# EAGLE design TIMER555 copy (EAGLE 9.6.2)
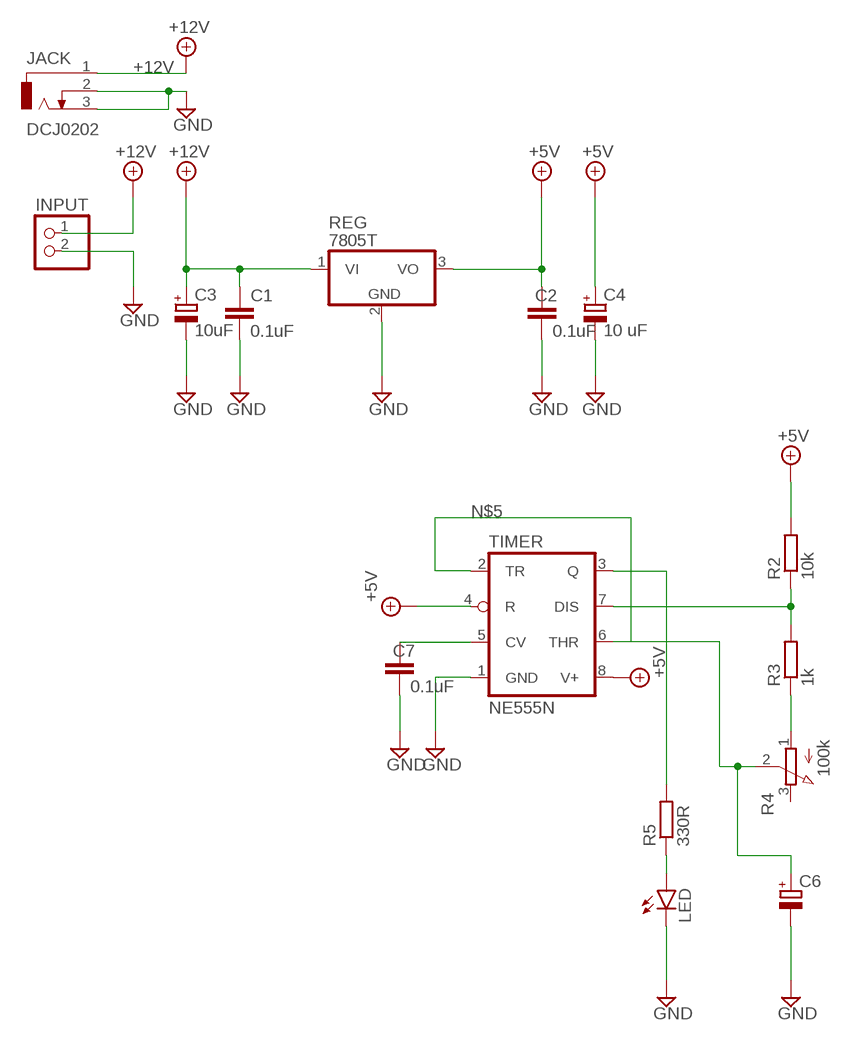
[diagram p0: schematic, sheet 1]

## Parts
C1  0.1uF  C-EU050-030X075  [C050-030X075]
C2  0.1uF  C-EU050-030X075  [C050-030X075]
C3  10uF  CPOL-EUE3.5-8  [E3,5-8]
C4  10 uF  CPOL-EUE3.5-8  [E3,5-8]
C6  CPOL-EUE3.5-8  [E3,5-8]
C7  0.1uF  C-EU050-030X075  [C050-030X075]
INPUT  PINHD-1X2  [1X02]
JACK  DCJ0202  [DCJ0202]
LED  LED5MM  [LED5MM]
R2  10k  R-EU_0207/10  [0207/10]
R3  1k  R-EU_0207/10  [0207/10]
R4  100k  3RP/1610N  [3RP/1610N]
R5  330R  R-EU_0207/10  [0207/10]
REG  7805T  [TO220H]
TIMER  NE555N  [DIL08]

## Nets
+5V [Power]: C2.1 C4.+ R2.2 REG.3(VO) TIMER.4(R) TIMER.8(V+)
+12V [Power]: C1.1 C3.+ INPUT.1 JACK.1 REG.1(VI)
GND [Power]: C1.2 C2.2 C3.- C4.- C6.- C7.2 INPUT.2 JACK.2 JACK.3 LED.K(C) REG.2(GND) TIMER.1(GND)
N$1: C7.1 TIMER.5(CV)
N$2: R2.1 R3.2 TIMER.7(DIS)
N$3: R3.1 R4.1(A)
N$5: C6.+ R4.2(S) TIMER.2(TR) TIMER.6(THR)
N$6: R5.2 TIMER.3(Q)
N$7: LED.A R5.1
Unconnected: R4.3(E)

## Library data of the parts
C1 C2 C7 = rcl:C-EU: CAPACITOR, European symbol; SPICEPREFIX: C
C3 C4 C6 = rcl:CPOL-EU: POLARIZED CAPACITOR, European symbol; SPICEPREFIX: C
INPUT = pinhead:PINHD-1X2: PIN HEADER
JACK = con-jack:DCJ0202: DC POWER JACK Source: DCJ0202.pdf; OC_FARNELL: unknown; OC_NEWARK: unknown
LED = led:LED: LED OSRAM: - CHIPLED LG R971, LG N971, LY N971, LG Q971, LY Q971, LO R971, LY R971 LH N974, LH R974 LS Q976, LO Q976, LY Q976 LO Q996 - Hyper CHIPLED LW Q18S LB Q993, LB Q99A, LB R99A - SideLED LS A670, LO A670, LY A670, LG A670, LP A670 LB A673, LV A673, LT A673, LW A673 LH A674 LY A675 LS A676, LA A676, LO A676, LY A676, LW A676 LS A679, LY A679, LG A679 - Hyper Micro SIDELED® LS Y876, LA Y876, LO Y876, LY Y876 LT Y87S - SmartLED LW L88C, LW L88S LB L89C, LB L89S, LG L890 LS L89K, LO L89K, LY L89K LS L896, LA L896, LO L896, LY L896 - TOPLED LS T670, LO T670, LY T670, LG T670, LP T670 LSG T670, LSP T670, LSY T670, LOP T670, LYG T670 LG T671, LOG T671, LSG T671 LB T673, LV T673, LT T673, LW T673 LH T674 LS T676, LA T676, LO T676, LY T676, LB T676, LH T676, LSB T676, LW T676 LB T67C, LV T67C, LT T67C, LS T67K, LO T67K, LY T67K, LW E67C LS E67B, LA E67B, LO E67B, LY E67B, LB E67C, LV E67C, LT E67C LW T67C LS T679, LY T679, LG T679 LS T770, LO T770, LY T770, LG T770, LP T770 LB T773, LV T773, LT T773, LW T773 LH T774 LS E675, LA E675, LY E675, LS T675 LS T776, LA T776, LO T776, LY T776, LB T776 LHGB T686 LT T68C, LB T68C - Hyper Mini TOPLED® LB M676 - Mini TOPLED Santana® LG M470 LS M47K, LO M47K, LY M47K Source: http://www.osram.convergy.de LUXEON: - LUMILED® LXK2-PW12-R00, LXK2-PW12-S00, LXK2-PW14-U00, LXK2-PW14-V00 LXK2-PM12-R00, LXK2-PM12-S00, LXK2-PM14-U00 LXK2-PE12-Q00, LXK2-PE12-R00, LXK2-PE12-S00, LXK2-PE14-T00, LXK2-PE14-U00 LXK2-PB12-K00, LXK2-PB12-L00, LXK2-PB12-M00, LXK2-PB14-N00, LXK2-PB14-P00, LXK2-PB14-Q00 LXK2-PR12-L00, LXK2-PR12-M00, LXK2-PR14-Q00, LXK2-PR14-R00 LXK2-PD12-Q00, LXK2-PD12-R00, LXK2-PD12-S00 LXK2-PH12-R00, LXK2-PH12-S00 LXK2-PL12-P00, LXK2-PL12-Q00, LXK2-PL12-R00 Source: www.luxeon.com KINGBRIGHT: KA-3528ASYC Source: www.kingbright.com
R2 R3 R5 = rcl:R-EU_: RESISTOR, European symbol; SPICEPREFIX: R
R4 = pot:3RP/1610N: 16mm Potentiometer one level Source: http://www.alphapotentiometers.net/html/16mm_pot_2.html
REG = linear:78*: Positive VOLTAGE REGULATOR Source: http://cache.national.com/ds/LM/LM78L05.pdf http://www.fairchildsemi.com/ds/LM/LM7805.pdf
TIMER = linear:*555: TIMER

## Net classes
0 default: width 0.305 mm, drill 0.305 mm, clearance 0.254 mm
1 Power: width 0.406 mm, drill 0.406 mm, clearance 0.305 mm

## Board
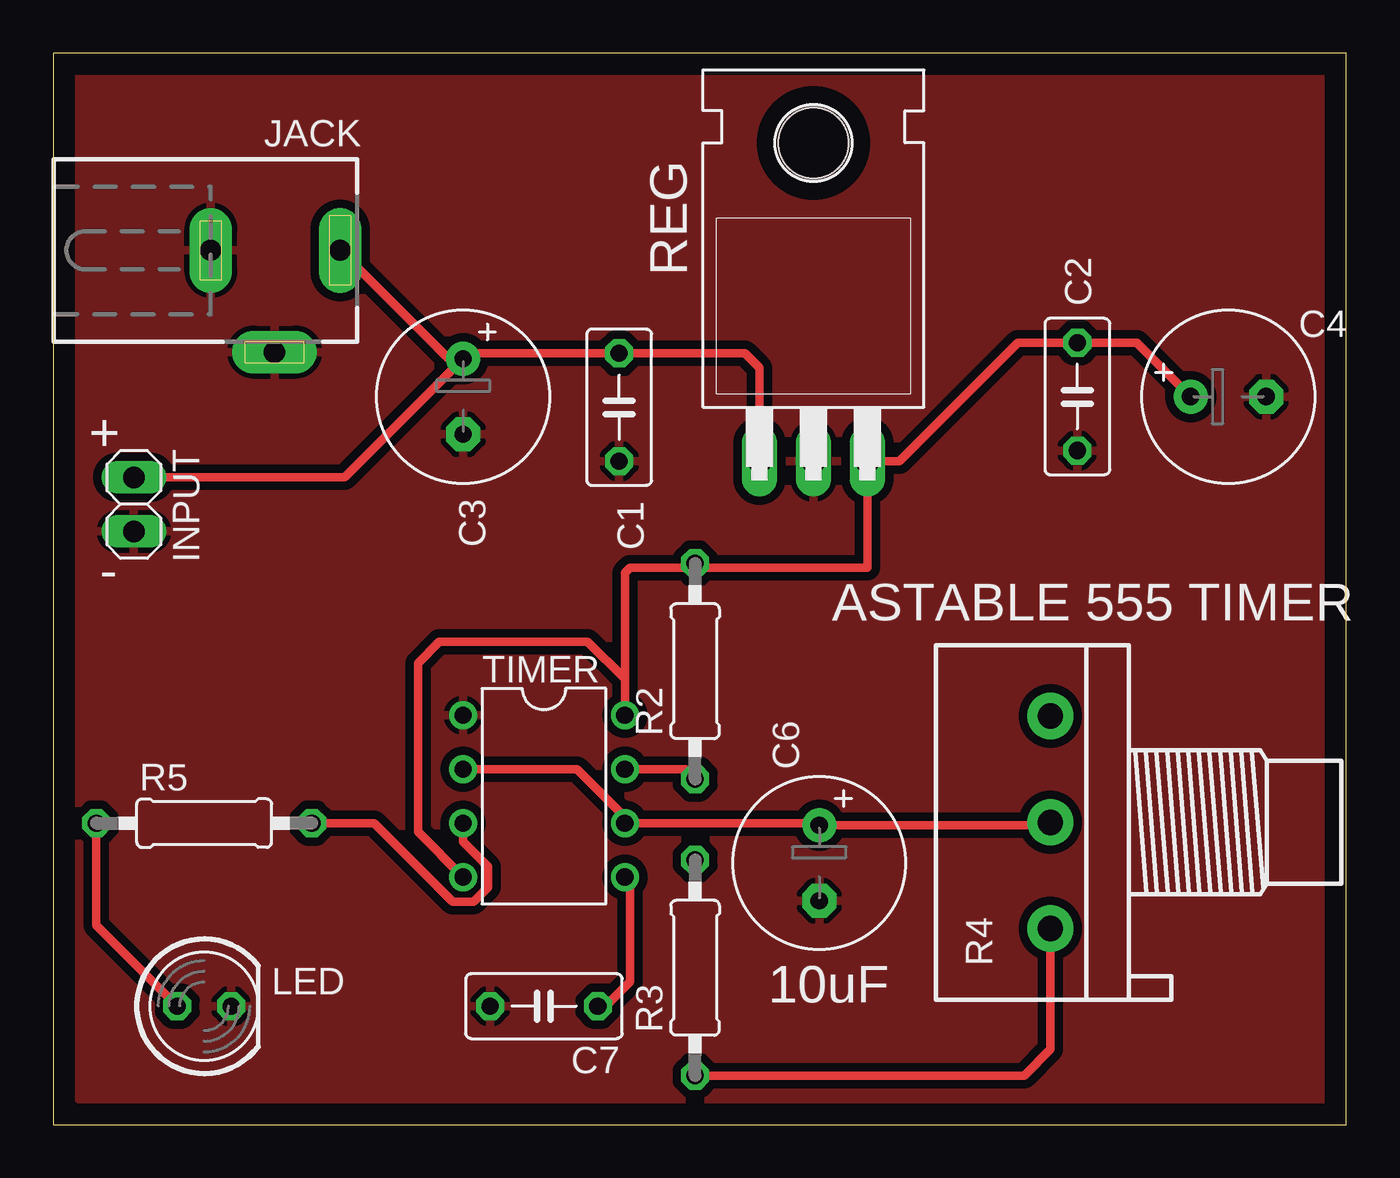
[diagram p1: board, top side]
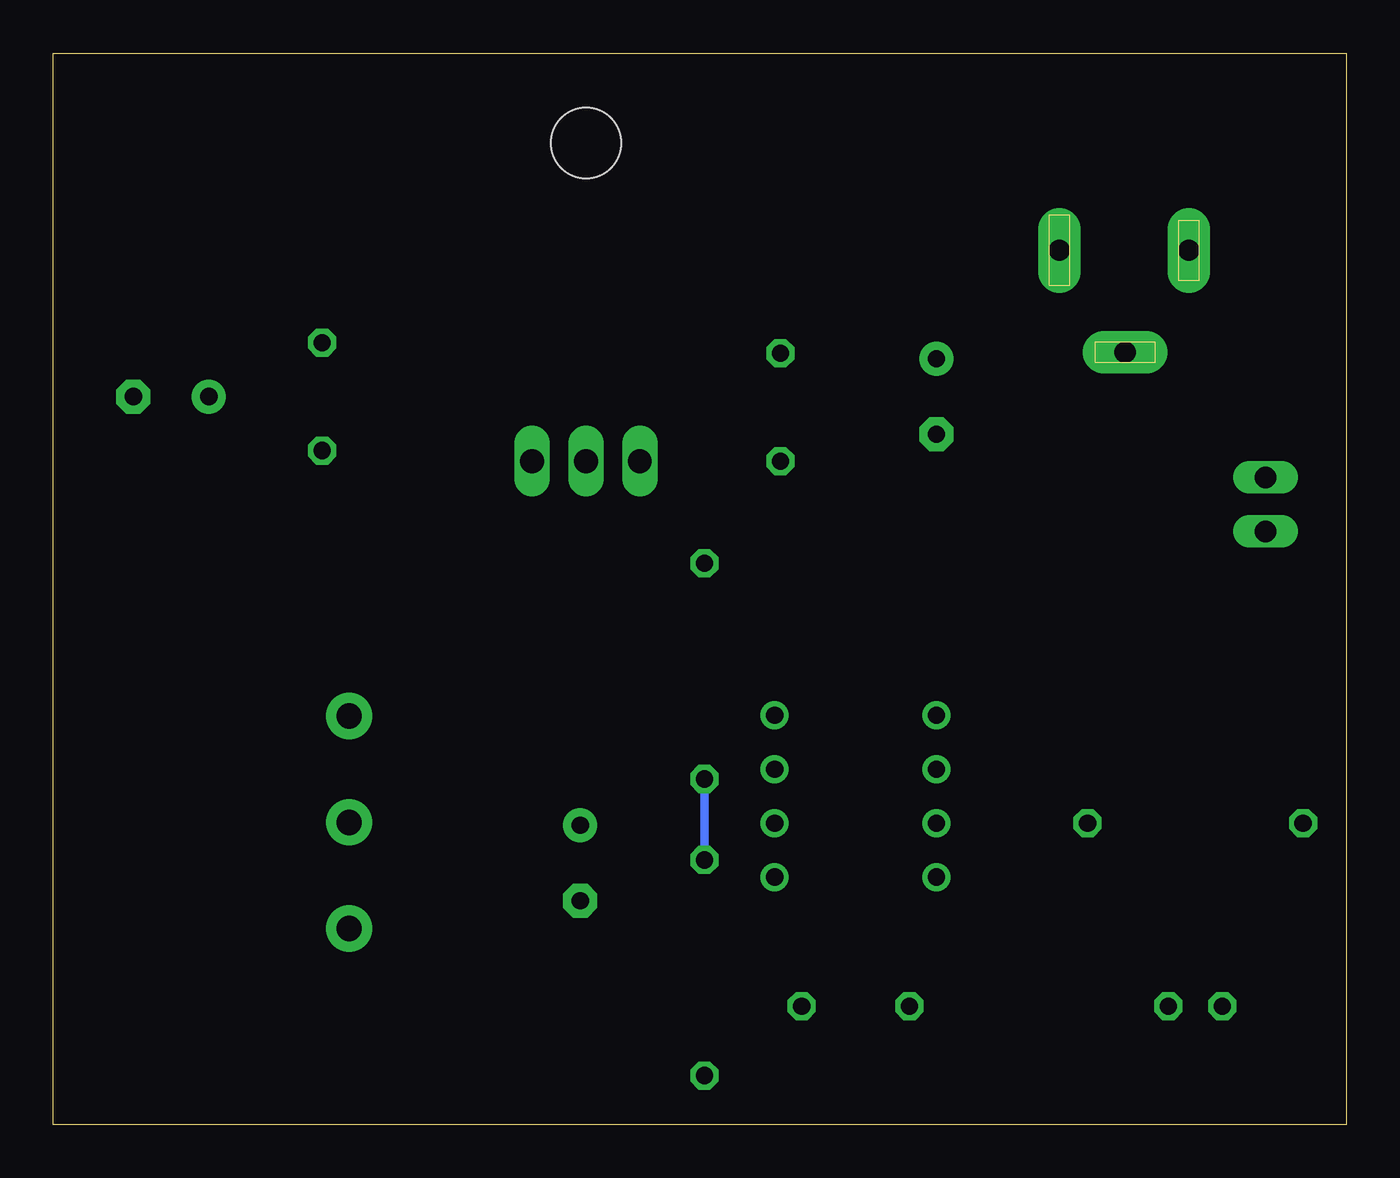
[diagram p2: board, bottom side, seen from below]

Size 60.94 x 50.47 mm. Coordinates in mm from the lower left corner, seen from the top.
Outline: 0,0 60.94,0 60.94,50.47 0,50.47 0,0
Copper layers (1*16): Top 0.035mm / dielectric 0.15mm / Bottom 0.035mm
Design rules "default": minimum track width 6mil, minimum drill 0.35mm, track to track 6mil, track to pad 6mil, pad to pad 6mil, via to via 6mil, smd to smd 6mil, copper to edge 40mil, drill to drill 6mil, minimum pad ring 10mil, minimum via ring 8mil, stop-mask expansion 4mil, vias tented up to drill 0mil, thermal gap 10mil

### Footprints (pad centres in the part's own frame; a part is rotated, then mirrored left to right if it is on the bottom)
C050-030X075 = drill 0.813 octagon: 1 -2.54,0; 2 2.54,0
E3,5-8 = drill 0.813 pad 1.6: + -1.778,0 | drill 0.813 pad 1.6 octagon: - 1.778,0
1X02 = drill 1.016 long: 1 -1.27,0; 2 1.27,0
DCJ0202 = drill 1 pad 2 long: 1 0,3.1; 2 4.8,0; 3 0,-3
LED5MM = drill 0.813 octagon: A -1.27,0; K 1.27,0
0207/10 = drill 0.813 octagon: 1 -5.08,0; 2 5.08,0
3RP/1610N = drill 1.2 pad 2.184: 1 -5,0; 2 0,0; 3 5,0
TO220H = drill 1.118 long: 1 -2.54,-10.16; 2 0,-10.16; 3 2.54,-10.16 | hole 3.302: 0,4.826
DIL08 = drill 0.813 pad 1.27: 1 -3.81,-3.81; 2 -1.27,-3.81; 3 1.27,-3.81; 4 3.81,-3.81; 5 3.81,3.81; 6 1.27,3.81; 7 -1.27,3.81; 8 -3.81,3.81

### Placement (x,y rotation side)
C1  26.67,33.79 270 top
C2  48.26,34.29 270 top
C3  19.32,34.29 270 top
C4  55.38,34.29 0 top
C6  36.1,12.32 270 top
C7  23.13,5.58 180 top
INPUT  3.81,29.21 270 top
JACK  10.43,41.18 270 top
LED  7.12,5.58 0 top
R2  30.25,21.36 90 top
R3  30.25,7.39 90 top
R4  46.99,14.24 90 top
R5  7.12,14.2 0 top
REG  35.83,41.41 0 top
TIMER  23.13,15.47 270 top

### Tracks (layer width: path | path; a pad name or v marks a point on that pad's centre or on a via)
+5V
  Top 0.406: TIMER.4 17.19,13.79 17.19,21.74 18.19,22.74 25.19,22.74 26.94,20.99 TIMER.8 26.94,25.99 27.19,26.24 30.05,26.24 R2.2 30.45,26.24 38.37,26.24 REG.3 39.87,31.25 45.45,36.83 C2.1 51.06,36.83 C4.+
+12V
  Top 0.406: C3.+ 18.64,36.07 JACK.1 | C3.+ 19.58,36.33 C1.1 32.6,36.33 33.29,35.64 REG.1 | C3.+ 13.73,30.48 INPUT.1
GND
  pour Top (isolate 0.4): 60.19,49.74 60.19,1.24 59.69,0.74 1.69,0.74 0.69,1.74 0.69,49.74
N$1
  Top 0.406: TIMER.5 27.19,11.41 27.19,6.74 26.03,5.58 C7.1
N$2
  Top 0.406: R2.1 29.79,16.74 TIMER.7
  Bottom 0.406: R3.2 R2.1
N$3
  Top 0.406: R4.1 46.99,3.54 45.76,2.31 R3.1
N$5
  Top 0.406: TIMER.2 24.69,16.74 27.19,14.24 27.19,14.2 TIMER.6 36,14.2 C6.+ 46.85,14.1 R4.2
N$6
  Top 0.406: R5.2 15.13,14.2 18.84,10.49 19.8,10.49 20.49,11.18 20.49,12.14 19.32,13.31 TIMER.3
N$7
  Top 0.406: R5.1 2.04,9.39 LED.A

### Text on the board
tNames: + | - | ASTABLE 555 TIMER | 10uF